# EAGLE design proto_shield_MEGA-REV3 (EAGLE 6.4)
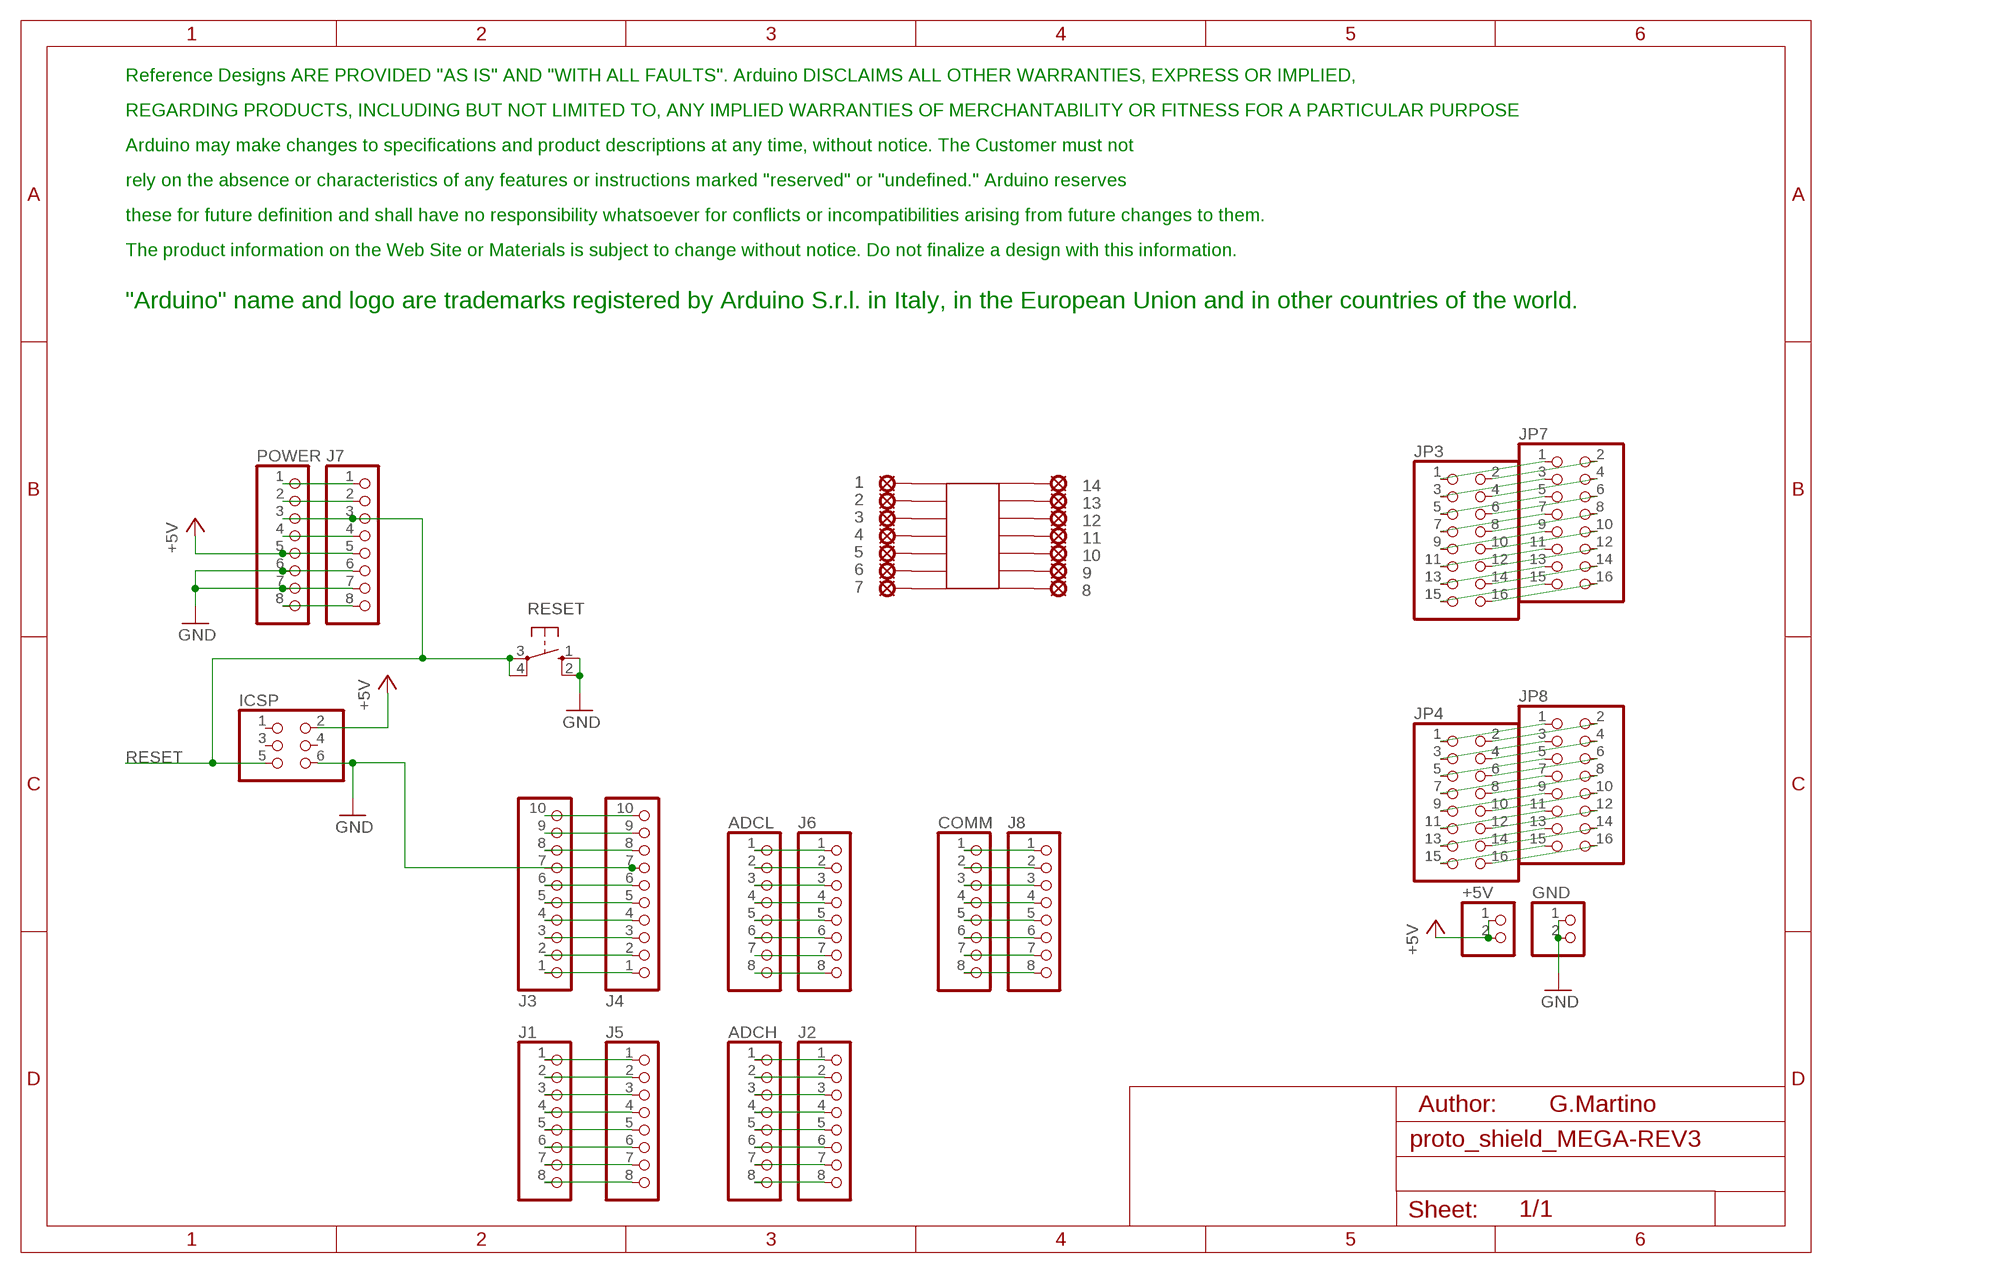
[diagram p0: schematic, sheet 1]

## Parts
1  LSP10  [LSP10]
2  LSP10  [LSP10]
3  LSP10  [LSP10]
4  LSP10  [LSP10]
5  LSP10  [LSP10]
6  LSP10  [LSP10]
7  LSP10  [LSP10]
8  LSP10  [LSP10]
9  LSP10  [LSP10]
10  LSP10  [LSP10]
11  LSP10  [LSP10]
12  LSP10  [LSP10]
13  LSP10  [LSP10]
14  LSP10  [LSP10]
+5V  PINHD-1X2  [1X02]
ADCH  PINHD-1X8TH  [1X08-TH]
ADCL  PINHD-1X8TH  [1X08-TH]
COMM  PINHD-1X8TH  [1X08-TH]
GND  PINHD-1X2  [1X02]
IC2  SMD-14  [SO-14NMW]
ICSP  PINHD-2X3  [2X03]
J1  PINHD-1X8TH  [1X08-TH]
J2  PINHD-1X8TH  [1X08-TH]
J3  PINHD-1X10TH  [1X10-TH]
J4  PINHD-1X10TH  [1X10-TH]
J5  PINHD-1X8TH  [1X08-TH]
J6  PINHD-1X8TH  [1X08-TH]
J7  PINHD-1X8TH  [1X08-TH]
J8  PINHD-1X8TH  [1X08-TH]
JP3  PINHD-2X8  [2X08]
JP4  PINHD-2X8  [2X08]
JP7  PINHD-2X8  [2X08]
JP8  PINHD-2X8  [2X08]
POWER  PINHD-1X8TH  [1X08-TH]
RESET  10-XX  [B3F-10XX]
U$1  DISCLAIMER_MINI  [DISCLAIMER]

## Nets
+5V: +5V.1 +5V.2 ICSP.2 J7.5 POWER.5
+9V: J7.8 POWER.8
GND: GND.1 GND.2 ICSP.6 J3.7 J4.7 J7.6 J7.7 POWER.6 POWER.7 RESET.1(S) RESET.2(S1)
N$2: J3.1 J4.1
N$3: J3.6 J4.6
N$5: J3.4 J4.4
N$6: J3.2 J4.2
N$7: J3.3 J4.3
N$8: J1.1 J5.1
N$9: J1.2 J5.2
N$10: J1.3 J5.3
N$11: J1.4 J5.4
N$12: J1.5 J5.5
N$13: J1.6 J5.6
N$14: J1.7 J5.7
N$15: J1.8 J5.8
N$18: ADCL.1 J6.1
N$19: ADCL.2 J6.2
N$20: ADCL.3 J6.3
N$21: ADCL.4 J6.4
N$22: ADCL.5 J6.5
N$23: ADCL.6 J6.6
N$24: 14.MP IC2.P$14
N$38: ADCL.7 J6.7
N$63: ADCL.8 J6.8
N$64: ADCH.1 J2.1
N$88: ADCH.2 J2.2
N$89: ADCH.3 J2.3
N$97: 13.MP IC2.P$13
N$98: 12.MP IC2.P$12
N$99: 11.MP IC2.P$11
N$100: 10.MP IC2.P$10
N$101: 9.MP IC2.P$9
N$102: 8.MP IC2.P$8
N$103: 7.MP IC2.P$7
N$104: 6.MP IC2.P$6
N$109: 5.MP IC2.P$5
N$110: 3.MP IC2.P$3
N$111: 2.MP IC2.P$2
N$112: 1.MP IC2.P$1
N$113: 4.MP IC2.P$4
N$116: ADCH.4 J2.4
N$121: ADCH.5 J2.5
N$124: ADCH.6 J2.6
N$125: J7.4 POWER.4
N$126: J3.9 J4.9
N$127: ADCH.7 J2.7
N$128: ADCH.8 J2.8
N$129: COMM.1 J8.1
N$130: COMM.2 J8.2
N$133: COMM.3 J8.3
N$134: COMM.4 J8.4
N$136: COMM.5 J8.5
N$137: COMM.6 J8.6
N$138: COMM.7 J8.7
N$139: COMM.8 J8.8
N$140: J3.5 J4.5
N$142: JP3.1 JP7.1
N$144: JP3.2 JP7.2
N$145: JP3.3 JP7.3
N$146: JP3.4 JP7.4
N$147: JP3.5 JP7.5
N$148: JP3.6 JP7.6
N$149: JP3.7 JP7.7
N$150: JP3.8 JP7.8
N$151: JP3.9 JP7.9
N$152: JP3.10 JP7.10
N$154: JP3.11 JP7.11
N$157: JP3.12 JP7.12
N$158: JP3.13 JP7.13
N$159: JP3.14 JP7.14
N$160: JP3.15 JP7.15
N$161: JP3.16 JP7.16
N$162: JP4.1 JP8.1
N$163: JP4.2 JP8.2
N$164: JP4.3 JP8.3
N$166: JP4.4 JP8.4
N$169: JP4.5 JP8.5
N$170: JP4.6 JP8.6
N$171: JP4.7 JP8.7
N$172: JP4.8 JP8.8
N$173: JP4.9 JP8.9
N$174: JP4.10 JP8.10
N$175: JP4.11 JP8.11
N$176: JP4.12 JP8.12
N$181: JP4.13 JP8.13
N$182: JP4.14 JP8.14
N$183: JP4.15 JP8.15
N$184: JP4.16 JP8.16
N$219: J7.2 POWER.2
N$220: J7.1 POWER.1
N$222: J3.8 J4.8
N$223: J3.10 J4.10
RESET: ICSP.5 J7.3 POWER.3 RESET.3(P) RESET.4(P1)
Unconnected: ICSP.1 ICSP.3 ICSP.4

## Notes on the sheet
- G.Martino

## Library data of the parts
1-14 = Smartprj:LSP10: SOLDER PAD drill 1.0 mm, distributor Buerklin, 12H555
+5V GND = pinhead:PINHD-1X2: PIN HEADER
ADCH ADCL COMM J1 J2 J5-J8 POWER = Smartprj:PINHD-1X8: PIN HEADER
IC2 = carduino:SMD-14
ICSP = Smartprj:PINHD-2X3: PIN HEADER
J3 J4 = Smartprj:PINHD-1X10: PIN HEADER
JP3 JP4 JP7 JP8 = pinhead:PINHD-2X8: PIN HEADER
RESET = switch-omron:10-XX: OMRON SWITCH
U$1 = Misc:DISCLAIMER_MINI

## Board
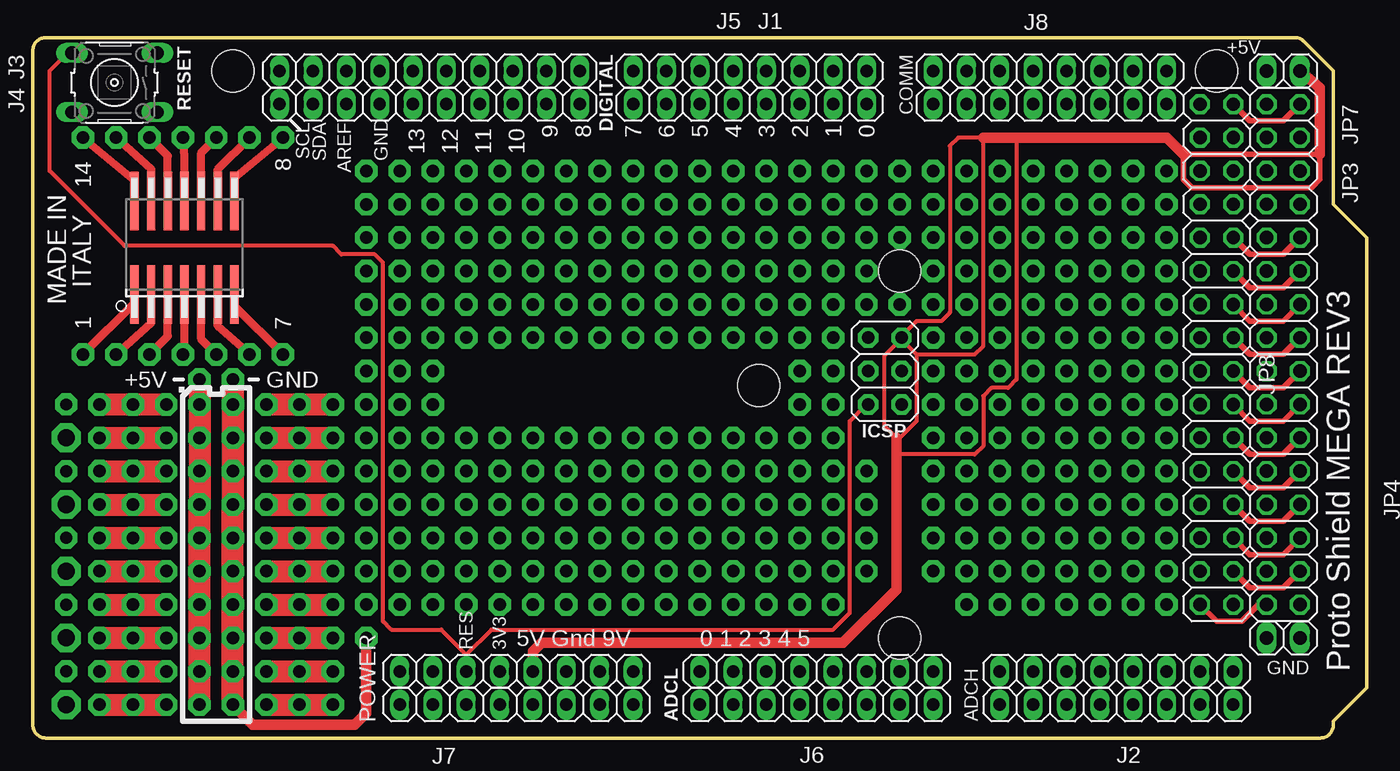
[diagram p1: board, top side]
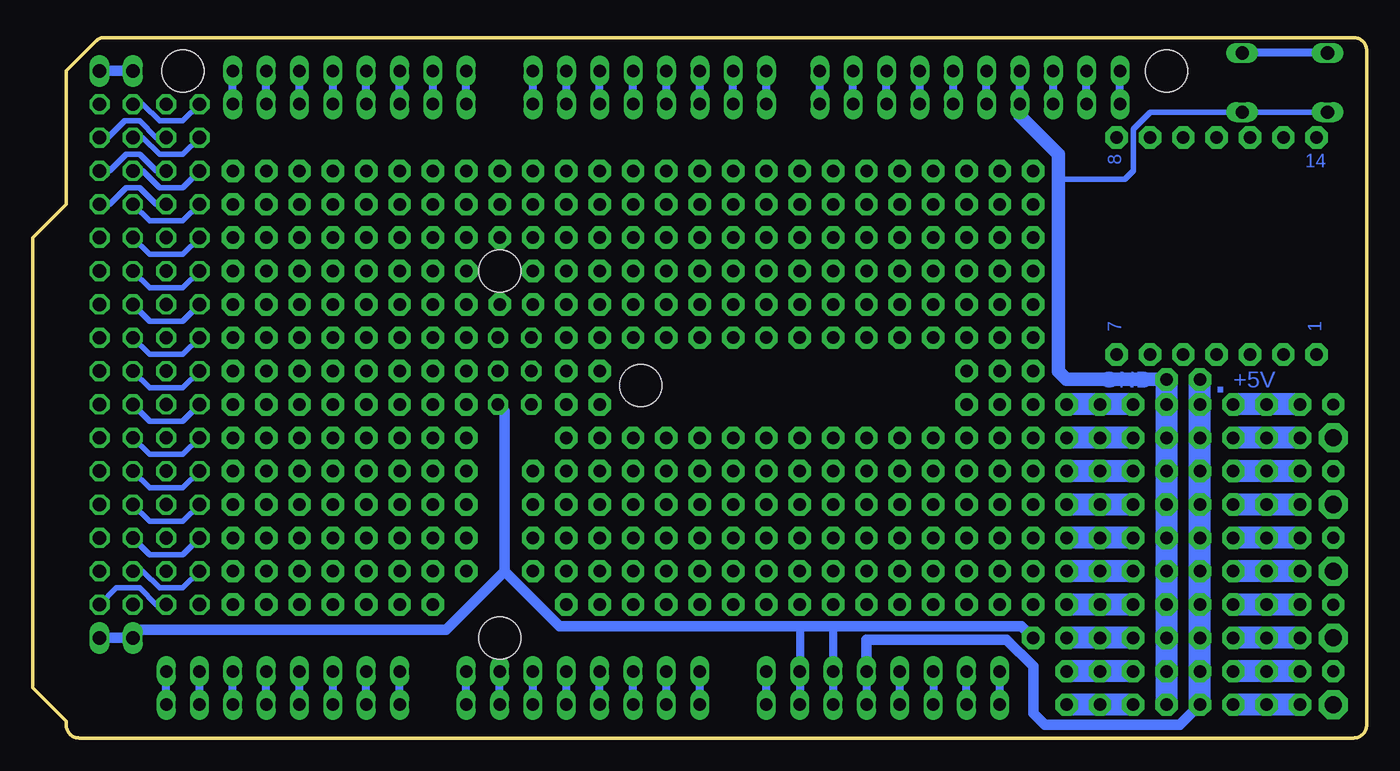
[diagram p2: board, bottom side, seen from below]

Size 101.6 x 53.34 mm. Coordinates in mm from the lower left corner, seen from the top.
Outline: 99.06,40.64 101.6,38.1 101.6,3.81 99.06,1.27 99.06,1 arc-90 98.06,0 1,0 arc-90 0,1 0,52.34 arc-90 1,53.34 96.11,53.34 arc-45 96.81,53.05 99.06,50.8 99.06,40.64
Copper layers (1*16): Top 0.035mm / dielectric 1.5mm / Bottom 0.035mm
Design rules "default *": minimum track width 10mil, minimum drill 24mil, track to track 8mil, track to pad 8mil, pad to pad 8mil, via to via 8mil, smd to smd 8mil, copper to edge 40mil, drill to drill 8mil, minimum pad ring 10mil, minimum via ring 8mil, stop-mask expansion 2mil, vias tented up to drill 0mil, thermal gap 10mil
Holes 3.2 mm at 15.24,50.8 66.04,7.62 55.3,26.84 66.04,35.56 90.17,50.8

### Footprints (pad centres in the part's own frame; a part is rotated, then mirrored left to right if it is on the bottom)
LSP10 = drill 0.95 pad 1.7 octagon: MP 0,0
1X02 = drill 1.016 long: 1 -1.27,0; 2 1.27,0
1X08-TH = drill 0.95 pad 1.422 long: 1 -8.89,0; 2 -6.35,0; 3 -3.81,0; 4 -1.27,0; 5 1.27,0; 6 3.81,0; 7 6.35,0; 8 8.89,0
SO-14NMW = smd 0.635 x 4.445: P$1 -3.048,-3.683; P$2 -1.778,-3.683; P$3 -0.508,-3.683; P$4 0.762,-3.683; P$5 2.032,-3.683; P$6 3.302,-3.683; P$7 4.572,-3.683; P$8 4.572,3.429; P$9 3.302,3.429; P$10 2.032,3.429; P$11 0.762,3.429; P$12 -0.508,3.429; P$13 -1.778,3.429; P$14 -3.048,3.429
2X03 = drill 0.95 pad 1.55 octagon: 1 -2.54,-1.27; 2 -2.54,1.27; 3 0,-1.27; 4 0,1.27; 5 2.54,-1.27; 6 2.54,1.27
1X10-TH = drill 0.95 pad 1.422 long: 1 -11.43,0; 2 -8.89,0; 3 -6.35,0; 4 -3.81,0; 5 -1.27,0; 6 1.27,0; 7 3.81,0; 8 6.35,0; 9 8.89,0; 10 11.43,0
2X08 = drill 1.016 octagon: 1 -8.89,-1.27; 2 -8.89,1.27; 3 -6.35,-1.27; 4 -6.35,1.27; 5 -3.81,-1.27; 6 -3.81,1.27; 7 -1.27,-1.27; 8 -1.27,1.27; 9 1.27,-1.27; 10 1.27,1.27; 11 3.81,-1.27; 12 3.81,1.27; 13 6.35,-1.27; 14 6.35,1.27; 15 8.89,-1.27; 16 8.89,1.27
B3F-10XX = drill 1.016 long: 1 -3.251,2.261; 2 3.251,2.261; 3 -3.251,-2.261; 4 3.251,-2.261

### Placement (x,y rotation side)
1  3.81,29.21 90 top
2  6.35,29.21 90 top
3  8.89,29.21 90 top
4  11.43,29.21 90 top
5  13.97,29.21 90 top
6  16.51,29.21 90 top
7  19.05,29.21 90 top
8  19.05,45.72 90 top
9  16.51,45.72 90 top
10  13.97,45.72 90 top
11  11.43,45.72 90 top
12  8.89,45.72 90 top
13  6.35,45.72 270 top
14  3.81,45.72 270 top
+5V  95.25,50.8 0 top
ADCH  82.55,2.54 0 top
ADCL  59.69,2.54 0 top
COMM  77.47,50.8 0 top
GND  95.25,7.62 0 top
IC2  10.79,37.47 0 top
ICSP  64.9,27.94 270 top
J1  54.61,50.8 180 top
J2  82.55,5.08 0 top
J3  30.23,50.8 180 top
J4  30.23,48.26 180 top
J5  54.61,48.26 180 top
J6  59.69,5.08 0 top
J7  36.83,2.54 0 top
J8  77.47,48.26 0 top
JP3  95.25,39.37 270 top
JP4  95.25,19.05 270 top
JP7  90.17,39.37 270 top
JP8  90.17,19.05 270 top
POWER  36.83,5.08 0 top
RESET  6.22,49.91 180 top
U$1  -5.71,-22.86 0 top  (outside the outline)

### Tracks (layer width: path | path; a pad name or v marks a point on that pad's centre or on a via)
+5V  (via drill 0.95 pad 1.7)
  Top 0.305: 66.17,30.4 64.87,29.11 64.87,23.77 65.79,22.86 | 66.17,30.61 67.31,31.75 69.22,31.75 69.85,32.38 69.85,45.09 70.48,45.72 72.39,45.72 72.39,29.84 71.75,29.21 67.31,29.21 | 66.17,30.35 67.31,29.21 | 67.31,29.21 67.31,24.13 66.04,22.86 | 66.04,21.59 71.75,21.59 72.39,22.23 72.39,26.04 73.03,26.67 74.3,26.67 74.93,27.3 74.93,45.72
  Top 0.406: 66.17,30.4 66.17,30.35 | 66.17,30.61 ICSP.2 | 87.63,44.45 98.04,44.45 98.04,42.55 97.41,41.91 88.27,41.91 87.63,42.55 87.63,44.45
  Top 0.813: POWER.5 38.1,6.6 38.73,7.24 61.72,7.24 65.79,11.3 65.79,22.86 | 72.39,45.72 74.93,45.72 86.36,45.72 87.63,44.45 | 98.04,44.45 98.04,49.53 +5V.2
  Top 1.676: v12.7,2.54 v12.7,5.08 v12.7,7.62 v12.7,10.16 v12.7,12.7 v12.7,15.24 v12.7,17.78 v12.7,20.32 v12.7,22.86 v12.7,25.4 v12.7,27.3
  Bottom 0.61: POWER.5 J7.5
  Bottom 0.813: POWER.5 38.1,7.49 27.43,7.49 25.4,5.46 25.4,1.91 24.51,1.02 14.22,1.02 v12.7,2.54 | +5V.2 +5V.1
  Bottom 1.676: v12.7,2.54 v12.7,27.3
+9V
  Bottom 0.61: J7.8 POWER.8
GND  (via drill 0.95 pad 1.7)
  Top 0.813: v25.4,7.62 25.4,1.91 24.51,1.02 16.76,1.02 v15.24,2.54
  Top 1.676: v15.24,2.54 v15.24,5.08 v15.24,7.62 v15.24,10.16 v15.24,12.7 v15.24,15.24 v15.24,17.78 v15.24,20.32 v15.24,22.86 v15.24,25.4 v15.24,27.3
  Bottom 0.406: RESET.2 3,47.62 3.81,47.62 3.83,47.65 RESET.1 16.48,47.65 17.78,46.35 17.78,43.18 18.41,42.55 23.5,42.55
  Bottom 0.61: J7.6 POWER.6 40.64,8.51 | J7.7 POWER.7 43.18,8.51 | 65.66,24.89 ICSP.6 | J4.7 J3.7
  Bottom 0.813: v25.4,7.62 26.29,8.51 40.64,8.51 43.18,8.51 61.47,8.51 65.66,12.7 | 65.66,12.7 65.66,24.89 | 26.42,47.37 J4.7 | 25.08,46.04 24.77,45.72 | GND.2 GND.1 93.34,8.26 70.1,8.26 65.66,12.7
  Bottom 1.016: 26.42,47.37 25.08,46.04 23.5,44.45 23.5,42.55 23.5,27.94 22.86,27.3 v15.24,27.3
  Bottom 1.676: v15.24,2.54 v15.24,27.3
N$2
  Bottom 0.61: J4.1 J3.1
N$3
  Bottom 0.61: J4.6 J3.6
N$4  (via drill 0.95 pad 1.7)
  other vias: 71.12,17.78
N$5
  Bottom 0.61: J4.4 J3.4
N$6
  Bottom 0.61: J4.2 J3.2
N$7
  Bottom 0.61: J4.3 J3.3
N$8
  Bottom 0.61: J5.1 J1.1
N$9
  Bottom 0.61: J5.2 J1.2
N$10
  Bottom 0.61: J5.3 J1.3
N$11
  Bottom 0.61: J5.4 J1.4
N$12
  Bottom 0.61: J5.5 J1.5
N$13
  Bottom 0.61: J5.6 J1.6
N$14
  Bottom 0.61: J5.7 J1.7
N$15
  Bottom 0.61: J5.8 J1.8
N$16
  Bottom 1.676: 17.78,2.54 22.86,2.54
N$17
  Bottom 1.676: 17.78,5.08 22.86,5.08
N$18
  Bottom 0.61: ADCL.1 J6.1
N$19
  Bottom 0.61: ADCL.2 J6.2
N$20
  Bottom 0.61: ADCL.3 J6.3
N$21
  Bottom 0.61: ADCL.4 J6.4
N$22
  Bottom 0.61: ADCL.5 J6.5
N$23
  Bottom 0.61: ADCL.6 J6.6
N$24
  Top 0.61: IC2.P$14 7.75,42.42 14.MP
N$25
  Bottom 1.676: 17.78,7.62 22.86,7.62
N$26
  Bottom 1.676: 5.08,5.08 10.16,5.08
N$27  (via drill 0.95 pad 1.7)
  Top 1.676: v17.78,5.08 v22.86,5.08
N$28  (via drill 0.95 pad 1.7)
  other vias: 20.32,5.08
N$29  (via drill 1.3 pad 2.18)
  other vias: 2.54,17.78
N$30  (via drill 0.9 pad 1.68)
  other vias: 2.54,25.4
N$31
  Bottom 1.676: 5.08,10.16 10.16,10.16
N$32
  Bottom 1.676: 5.08,7.62 10.16,7.62
N$33  (via drill 0.95 pad 1.7)
  other vias: 7.62,5.08
N$34  (via drill 0.95 pad 1.7)
  Top 1.676: v5.08,5.08 v10.16,5.08
N$35  (via drill 1.3 pad 2.18)
  other vias: 2.54,22.86
N$36  (via drill 0.95 pad 1.7)
  other vias: 20.32,7.62
N$37  (via drill 0.95 pad 1.7)
  Top 1.676: v17.78,7.62 v22.86,7.62
N$38
  Bottom 0.61: ADCL.7 J6.7
N$39
  Bottom 1.676: 5.08,2.54 10.16,2.54
N$40  (via drill 0.9 pad 1.68)
  other vias: 2.54,5.08
N$41  (via drill 0.95 pad 1.7)
  Top 1.676: v5.08,7.62 v10.16,7.62
N$42  (via drill 0.95 pad 1.7)
  other vias: 7.62,7.62
N$43
  Bottom 1.676: 5.08,12.7 10.16,12.7
N$44  (via drill 1.3 pad 2.18)
  other vias: 2.54,7.62
N$45  (via drill 0.95 pad 1.7)
  other vias: 45.72,10.16
N$46  (via drill 0.95 pad 1.7)
  other vias: 27.94,10.16
N$47  (via drill 0.95 pad 1.7)
  other vias: 25.4,10.16
N$48  (via drill 0.95 pad 1.7)
  Top 1.676: v17.78,10.16 v22.86,10.16
N$49  (via drill 0.95 pad 1.7)
  other vias: 20.32,10.16
N$50
  Bottom 1.676: 5.08,15.24 10.16,15.24
N$51
  Bottom 1.676: 5.08,17.78 10.16,17.78
N$52
  Bottom 1.676: 5.08,20.32 10.16,20.32
N$53
  Bottom 1.676: 5.08,22.86 10.16,22.86
N$54  (via drill 0.95 pad 1.7)
  other vias: 7.62,10.16
N$55  (via drill 0.95 pad 1.7)
  Top 1.676: v5.08,10.16 v10.16,10.16
N$56  (via drill 0.9 pad 1.68)
  other vias: 2.54,10.16
N$57  (via drill 0.95 pad 1.7)
  other vias: 53.34,12.7
N$58  (via drill 0.95 pad 1.7)
  other vias: 27.94,12.7
N$59  (via drill 0.95 pad 1.7)
  other vias: 25.4,12.7
N$60
  Bottom 1.676: 5.08,25.4 10.16,25.4
N$61  (via drill 0.95 pad 1.7)
  other vias: 20.32,12.7
N$62  (via drill 0.95 pad 1.7)
  Top 1.676: v17.78,12.7 v22.86,12.7
N$63
  Bottom 0.61: ADCL.8 J6.8
N$64
  Bottom 0.61: ADCH.1 J2.1
N$65  (via drill 0.95 pad 1.7)
  Top 1.676: v5.08,12.7 v10.16,12.7
N$66  (via drill 0.95 pad 1.7)
  other vias: 7.62,12.7
N$67  (via drill 0.95 pad 1.7)
  Top 1.676: v5.08,22.86 v10.16,22.86
N$68  (via drill 1.3 pad 2.18)
  other vias: 2.54,12.7
N$69  (via drill 0.95 pad 1.7)
  other vias: 43.18,15.24
N$70  (via drill 0.95 pad 1.7)
  other vias: 27.94,15.24
N$71  (via drill 0.95 pad 1.7)
  other vias: 25.4,15.24
N$72  (via drill 0.95 pad 1.7)
  Top 1.676: v17.78,15.24 v22.86,15.24
N$73  (via drill 0.95 pad 1.7)
  other vias: 20.32,15.24
N$74  (via drill 0.95 pad 1.7)
  other vias: 7.62,22.86
N$75  (via drill 0.95 pad 1.7)
  other vias: 7.62,20.32
N$76  (via drill 0.95 pad 1.7)
  Top 1.676: v22.86,22.86 v20.32,22.86 v17.78,22.86
N$77  (via drill 0.95 pad 1.7)
  Top 1.676: v22.86,20.32 v20.32,20.32 v17.78,20.32
N$78  (via drill 0.95 pad 1.7)
  other vias: 7.62,15.24
N$79  (via drill 0.95 pad 1.7)
  Top 1.676: v5.08,15.24 v10.16,15.24
N$80  (via drill 0.9 pad 1.68)
  other vias: 2.54,15.24
N$81  (via drill 0.95 pad 1.7)
  other vias: 58.42,17.78
N$82  (via drill 0.95 pad 1.7)
  other vias: 27.94,17.78
N$83  (via drill 0.95 pad 1.7)
  other vias: 25.4,17.78
N$84  (via drill 0.95 pad 1.7)
  Top 1.676: v5.08,17.78 v10.16,17.78
N$85  (via drill 0.95 pad 1.7)
  other vias: 20.32,17.78
N$86  (via drill 0.95 pad 1.7)
  Top 1.676: v17.78,17.78 v22.86,17.78
N$87  (via drill 0.95 pad 1.7)
  Top 1.676: v5.08,20.32 v10.16,20.32
N$88
  Bottom 0.61: ADCH.2 J2.2
N$89
  Bottom 0.61: ADCH.3 J2.3
N$90  (via drill 0.95 pad 1.7)
  other vias: 7.62,17.78
N$91  (via drill 0.95 pad 1.7)
  other vias: 53.34,30.48
N$92  (via drill 0.9 pad 1.68)
  other vias: 2.54,20.32
N$93  (via drill 0.95 pad 1.7)
  other vias: 60.96,20.32
N$94  (via drill 0.95 pad 1.7)
  other vias: 27.94,20.32
N$95  (via drill 0.95 pad 1.7)
  other vias: 25.4,20.32
N$96  (via drill 0.95 pad 1.7)
  other vias: 58.42,30.48
N$97
  Top 0.61: IC2.P$13 9.02,43.31 13.MP
N$98
  Top 0.61: IC2.P$12 10.29,44.32 12.MP
N$99
  Top 0.61: IC2.P$11 11.56,44.32 11.MP
N$100
  Top 0.61: IC2.P$10 12.83,44.58 10.MP
N$101
  Top 0.61: IC2.P$9 14.1,43.31 9.MP
N$102
  Top 0.61: IC2.P$8 15.37,42.67 8.MP
N$103
  Top 0.61: IC2.P$7 15.37,32.89 7.MP
N$104
  Top 0.61: IC2.P$6 14.1,31.37 6.MP
N$105  (via drill 0.95 pad 1.7)
  other vias: 68.58,22.86
N$106  (via drill 0.95 pad 1.7)
  other vias: 27.94,22.86
N$107  (via drill 0.95 pad 1.7)
  other vias: 25.4,22.86
N$108  (via drill 0.95 pad 1.7)
  other vias: 60.96,27.94
N$109
  Top 0.61: IC2.P$5 12.83,30.35 5.MP
N$110
  Top 0.61: IC2.P$3 10.29,30.61 3.MP
N$111
  Top 0.61: IC2.P$2 9.02,31.62 2.MP
N$112
  Top 0.61: IC2.P$1 7.75,33.15 1.MP
N$113
  Top 0.61: IC2.P$4 11.56,29.21 4.MP
N$114  (via drill 0.95 pad 1.7)
  other vias: 58.42,27.94
N$115  (via drill 0.95 pad 1.7)
  other vias: 58.42,22.86
N$116
  Bottom 0.61: ADCH.4 J2.4
N$117  (via drill 0.95 pad 1.7)
  other vias: 60.96,25.4
N$118  (via drill 0.95 pad 1.7)
  Top 1.676: v22.86,25.4 v20.32,25.4 v17.78,25.4
N$119  (via drill 0.95 pad 1.7)
  other vias: 27.94,25.4
N$120  (via drill 0.95 pad 1.7)
  other vias: 25.4,25.4
N$121
  Bottom 0.61: ADCH.5 J2.5
N$122  (via drill 0.95 pad 1.7)
  other vias: 53.34,22.86
N$123  (via drill 0.95 pad 1.7)
  other vias: 25.4,43.18
N$124
  Bottom 0.61: ADCH.6 J2.6
N$125
  Bottom 0.61: J7.4 POWER.4
N$126
  Bottom 0.61: J4.9 J3.9
N$127
  Bottom 0.61: ADCH.7 J2.7
N$128
  Bottom 0.61: ADCH.8 J2.8
N$129
  Bottom 0.61: J8.1 COMM.1
N$130
  Bottom 0.61: J8.2 COMM.2
N$131  (via drill 0.95 pad 1.7)
  other vias: 27.94,27.94
N$132  (via drill 0.95 pad 1.7)
  other vias: 25.4,27.94
N$133
  Bottom 0.61: J8.3 COMM.3
N$134
  Bottom 0.61: J8.4 COMM.4
N$135  (via drill 0.95 pad 1.7)
  other vias: 25.4,30.48
N$136
  Bottom 0.61: J8.5 COMM.5
N$137
  Bottom 0.61: J8.6 COMM.6
N$138
  Bottom 0.61: J8.7 COMM.7
N$139
  Bottom 0.61: J8.8 COMM.8
N$140
  Bottom 0.61: J4.5 J3.5
N$141  (via drill 0.95 pad 1.7)
  other vias: 63.5,20.32
N$142
  Bottom 0.406: JP7.1 90.17,46.99 91.95,46.99 93.22,48.26 JP3.1
N$143  (via drill 0.95 pad 1.7)
  other vias: 27.94,30.48
N$144
  Top 0.406: JP3.2 95.25,46.99 92.71,46.99 JP7.2
N$145
  Bottom 0.406: JP7.3 90.17,44.45 91.95,44.45 93.22,45.72 JP3.3
N$146
  Bottom 0.406: JP3.4 95.89,45.72 94.61,46.99 93.47,46.99 92.2,45.72 JP7.4
N$147
  Bottom 0.406: JP7.5 90.17,41.91 91.95,41.91 93.22,43.18 JP3.5
N$148
  Bottom 0.406: JP3.6 95.76,43.18 94.49,44.45 93.47,44.45 92.2,43.18 JP7.6
N$149
  Bottom 0.406: JP7.7 90.17,39.37 92.71,39.37 JP3.7
N$150
  Bottom 0.406: JP3.8 95.76,40.64 94.49,41.91 93.47,41.91 92.2,40.64 JP7.8
N$151
  Bottom 0.406: JP7.9 90.17,36.83 92.71,36.83 JP3.9
N$152
  Top 0.406: JP3.10 95.25,36.83 92.71,36.83 JP7.10
N$153  (via drill 0.95 pad 1.7)
  other vias: 55.88,33.02
N$154
  Bottom 0.406: JP7.11 90.17,34.29 92.71,34.29 JP3.11
N$155  (via drill 0.95 pad 1.7)
  other vias: 27.94,33.02
N$156  (via drill 0.95 pad 1.7)
  other vias: 25.4,33.02
N$157
  Top 0.406: JP3.12 95.25,34.29 92.71,34.29 JP7.12
N$158
  Bottom 0.406: JP7.13 90.17,31.75 92.71,31.75 JP3.13
N$159
  Top 0.406: JP3.14 95.25,31.75 92.71,31.75 JP7.14
N$160
  Bottom 0.406: JP7.15 90.17,29.21 92.71,29.21 JP3.15
N$161
  Top 0.406: JP3.16 95.25,29.21 92.71,29.21 JP7.16
N$162
  Bottom 0.406: JP8.1 90.17,26.67 92.71,26.67 JP4.1
N$163
  Top 0.406: JP4.2 95.25,26.67 92.71,26.67 JP8.2
N$164
  Bottom 0.406: JP8.3 90.17,24.13 92.71,24.13 JP4.3
N$165  (via drill 0.95 pad 1.7)
  other vias: 50.8,35.56
N$166
  Top 0.406: JP4.4 95.25,24.13 92.71,24.13 JP8.4
N$167  (via drill 0.95 pad 1.7)
  other vias: 27.94,35.56
N$168  (via drill 0.95 pad 1.7)
  other vias: 25.4,35.56
N$169
  Bottom 0.406: JP8.5 90.17,21.59 92.71,21.59 JP4.5
N$170
  Top 0.406: JP4.6 95.25,21.59 92.71,21.59 JP8.6
N$171
  Bottom 0.406: JP8.7 90.17,19.05 92.71,19.05 JP4.7
N$172
  Top 0.406: JP4.8 95.25,19.05 92.71,19.05 JP8.8
N$173
  Bottom 0.406: JP8.9 90.17,16.51 92.71,16.51 JP4.9
N$174
  Top 0.406: JP4.10 95.25,16.51 92.71,16.51 JP8.10
N$175
  Bottom 0.406: JP8.11 90.17,13.97 92.71,13.97 JP4.11
N$176
  Top 0.406: JP4.12 95.25,13.97 92.71,13.97 JP8.12
N$177  (via drill 0.95 pad 1.7)
  other vias: 43.18,38.1
N$178  (via drill 0.95 pad 1.7)
  Top 1.676: v5.08,25.4 v10.16,25.4
N$179  (via drill 0.95 pad 1.7)
  other vias: 27.94,38.1
N$180  (via drill 0.95 pad 1.7)
  other vias: 25.4,38.1
N$181
  Bottom 0.406: JP8.13 90.17,11.43 91.95,11.43 93.22,12.7 JP4.13
N$182
  Top 0.406: JP4.14 95.25,11.43 92.71,11.43 JP8.14
N$183
  Top 0.406: JP8.15 90.17,8.89 92.08,8.89 93.34,10.16 JP4.15
N$184
  Bottom 0.406: JP4.16 95.25,11.43 93.47,11.43 92.2,10.16 JP8.16
N$185  (via drill 0.95 pad 1.7)
  other vias: 68.58,38.1
N$186  (via drill 0.95 pad 1.7)
  other vias: 68.58,33.02
N$187  (via drill 0.95 pad 1.7)
  other vias: 68.58,30.48
N$188  (via drill 0.95 pad 1.7)
  other vias: 68.58,27.94
N$189  (via drill 0.95 pad 1.7)
  other vias: 63.5,40.64
N$190  (via drill 0.95 pad 1.7)
  other vias: 7.62,25.4
N$191  (via drill 0.95 pad 1.7)
  other vias: 27.94,40.64
N$192  (via drill 0.95 pad 1.7)
  other vias: 25.4,40.64
N$193  (via drill 0.95 pad 1.7)
  other vias: 68.58,25.4
N$194  (via drill 0.95 pad 1.7)
  other vias: 68.58,20.32
N$195  (via drill 0.95 pad 1.7)
  other vias: 68.58,43.18
N$196  (via drill 0.95 pad 1.7)
  other vias: 68.58,40.64
N$197  (via drill 0.95 pad 1.7)
  other vias: 68.58,35.56
N$198  (via drill 0.95 pad 1.7)
  other vias: 71.12,33.02
N$199  (via drill 0.95 pad 1.7)
  other vias: 71.12,30.48
N$200  (via drill 0.95 pad 1.7)
  other vias: 71.12,27.94
N$201  (via drill 0.95 pad 1.7)
  other vias: 38.1,43.18
N$202  (via drill 0.95 pad 1.7)
  other vias: 71.12,25.4
N$203  (via drill 0.95 pad 1.7)
  other vias: 27.94,43.18
N$204  (via drill 0.95 pad 1.7)
  other vias: 71.12,22.86
N$205  (via drill 0.95 pad 1.7)
  other vias: 71.12,20.32
N$206  (via drill 0.95 pad 1.7)
  other vias: 71.12,43.18
N$207  (via drill 0.95 pad 1.7)
  other vias: 71.12,40.64
N$208  (via drill 0.95 pad 1.7)
  other vias: 71.12,38.1
N$209  (via drill 0.95 pad 1.7)
  other vias: 71.12,35.56
N$210  (via drill 0.95 pad 1.7)
  other vias: 73.66,17.78
N$211  (via drill 0.95 pad 1.7)
  other vias: 73.66,33.02
N$212  (via drill 0.95 pad 1.7)
  other vias: 73.66,30.48
N$213  (via drill 0.95 pad 1.7)
  other vias: 73.66,27.94
N$214  (via drill 0.95 pad 1.7)
  other vias: 73.66,25.4
N$215  (via drill 0.95 pad 1.7)
  other vias: 73.66,22.86
N$216  (via drill 0.95 pad 1.7)
  other vias: 73.66,20.32
N$217  (via drill 0.95 pad 1.7)
  other vias: 73.66,43.18
N$218  (via drill 0.95 pad 1.7)
  other vias: 73.66,40.64
N$219
  Bottom 0.61: J7.2 POWER.2
N$220
  Bottom 0.61: J7.1 POWER.1
N$221  (via drill 0.95 pad 1.7)
  other vias: 73.66,38.1
N$222
  Bottom 0.61: J4.8 J3.8
N$223
  Bottom 0.61: J4.10 J3.10
N$224  (via drill 0.95 pad 1.7)
  other vias: 73.66,35.56
N$225  (via drill 0.95 pad 1.7)
  other vias: 76.2,17.78
N$226  (via drill 0.95 pad 1.7)
  other vias: 76.2,33.02
N$227  (via drill 0.95 pad 1.7)
  other vias: 30.48,38.1
N$228  (via drill 0.95 pad 1.7)
  other vias: 33.02,38.1
N$229  (via drill 0.95 pad 1.7)
  other vias: 30.48,35.56
N$230  (via drill 0.95 pad 1.7)
  other vias: 33.02,35.56
N$231  (via drill 0.95 pad 1.7)
  other vias: 30.48,33.02
N$232  (via drill 0.95 pad 1.7)
  other vias: 33.02,33.02
N$233  (via drill 0.95 pad 1.7)
  other vias: 35.56,35.56
N$234  (via drill 0.95 pad 1.7)
  other vias: 35.56,33.02
N$235  (via drill 0.95 pad 1.7)
  other vias: 33.02,30.48
N$236  (via drill 0.95 pad 1.7)
  other vias: 35.56,30.48
N$237  (via drill 0.95 pad 1.7)
  other vias: 38.1,33.02
N$238  (via drill 0.95 pad 1.7)
  other vias: 38.1,35.56
N$239  (via drill 0.95 pad 1.7)
  other vias: 38.1,30.48
N$240  (via drill 0.95 pad 1.7)
  other vias: 40.64,33.02
N$241  (via drill 0.95 pad 1.7)
  other vias: 40.64,35.56
N$242  (via drill 0.95 pad 1.7)
  other vias: 38.1,38.1
N$243  (via drill 0.95 pad 1.7)
  other vias: 35.56,38.1
N$244  (via drill 0.95 pad 1.7)
  other vias: 76.2,30.48
N$245  (via drill 0.95 pad 1.7)
  other vias: 33.02,40.64
N$246  (via drill 0.95 pad 1.7)
  other vias: 35.56,40.64
N$247  (via drill 0.95 pad 1.7)
  other vias: 30.48,40.64
N$248  (via drill 0.95 pad 1.7)
  other vias: 30.48,43.18
N$249  (via drill 0.95 pad 1.7)
  other vias: 33.02,43.18
N$250  (via drill 0.95 pad 1.7)
  other vias: 76.2,27.94
N$251  (via drill 0.95 pad 1.7)
  other vias: 30.48,30.48
N$252  (via drill 0.95 pad 1.7)
  other vias: 30.48,27.94
N$253  (via drill 0.95 pad 1.7)
  other vias: 76.2,25.4
N$254  (via drill 0.95 pad 1.7)
  other vias: 76.2,22.86
N$255  (via drill 0.95 pad 1.7)
  other vias: 76.2,20.32
N$256  (via drill 0.95 pad 1.7)
  other vias: 76.2,43.18
N$257  (via drill 0.95 pad 1.7)
  other vias: 76.2,40.64
N$258  (via drill 0.95 pad 1.7)
  other vias: 76.2,38.1
N$259  (via drill 0.95 pad 1.7)
  other vias: 33.02,22.86
N$260  (via drill 0.95 pad 1.7)
  other vias: 76.2,35.56
N$261  (via drill 0.95 pad 1.7)
  other vias: 35.56,22.86
N$262  (via drill 0.95 pad 1.7)
  other vias: 38.1,22.86
N$263  (via drill 0.95 pad 1.7)
  other vias: 40.64,22.86
N$264  (via drill 0.95 pad 1.7)
  other vias: 78.74,17.78
N$265  (via drill 0.95 pad 1.7)
  other vias: 78.74,33.02
N$266  (via drill 0.95 pad 1.7)
  other vias: 78.74,30.48
N$267  (via drill 0.95 pad 1.7)
  other vias: 43.18,30.48
N$268  (via drill 0.95 pad 1.7)
  other vias: 40.64,30.48
N$269  (via drill 0.95 pad 1.7)
  other vias: 45.72,30.48
N$270  (via drill 0.95 pad 1.7)
  other vias: 78.74,27.94
N$271  (via drill 0.95 pad 1.7)
  other vias: 30.48,25.4
N$272  (via drill 0.95 pad 1.7)
  other vias: 30.48,22.86
N$273  (via drill 0.95 pad 1.7)
  other vias: 30.48,20.32
N$274  (via drill 0.95 pad 1.7)
  other vias: 33.02,15.24
N$275  (via drill 0.95 pad 1.7)
  other vias: 33.02,17.78
N$276  (via drill 0.95 pad 1.7)
  other vias: 38.1,17.78
N$277  (via drill 0.95 pad 1.7)
  other vias: 35.56,17.78
N$278  (via drill 0.95 pad 1.7)
  other vias: 35.56,15.24
N$279  (via drill 0.95 pad 1.7)
  other vias: 30.48,15.24
N$280  (via drill 0.95 pad 1.7)
  other vias: 30.48,17.78
N$281  (via drill 0.95 pad 1.7)
  other vias: 38.1,20.32
N$282  (via drill 0.95 pad 1.7)
  other vias: 40.64,20.32
N$283  (via drill 0.95 pad 1.7)
  other vias: 38.1,15.24
N$284  (via drill 0.95 pad 1.7)
  other vias: 30.48,12.7
N$285  (via drill 0.95 pad 1.7)
  other vias: 33.02,12.7
N$286  (via drill 0.95 pad 1.7)
  other vias: 30.48,10.16
N$287  (via drill 0.95 pad 1.7)
  other vias: 78.74,25.4
N$288  (via drill 0.95 pad 1.7)
  other vias: 78.74,22.86
N$289  (via drill 0.95 pad 1.7)
  other vias: 33.02,10.16
N$290  (via drill 0.95 pad 1.7)
  other vias: 35.56,10.16
N$291  (via drill 0.95 pad 1.7)
  other vias: 35.56,12.7
N$292  (via drill 0.95 pad 1.7)
  other vias: 38.1,12.7
N$293  (via drill 0.95 pad 1.7)
  other vias: 40.64,17.78
N$294  (via drill 0.95 pad 1.7)
  other vias: 43.18,17.78
N$295  (via drill 0.95 pad 1.7)
  other vias: 43.18,20.32
N$296  (via drill 0.95 pad 1.7)
  other vias: 45.72,20.32
N$297  (via drill 0.95 pad 1.7)
  other vias: 45.72,22.86
N$298  (via drill 0.95 pad 1.7)
  other vias: 43.18,22.86
N$299  (via drill 0.95 pad 1.7)
  other vias: 48.26,22.86
N$300  (via drill 0.95 pad 1.7)
  other vias: 78.74,20.32
N$301  (via drill 0.95 pad 1.7)
  other vias: 78.74,43.18
N$302  (via drill 0.95 pad 1.7)
  other vias: 78.74,40.64
N$303  (via drill 0.95 pad 1.7)
  other vias: 78.74,38.1
N$304  (via drill 0.95 pad 1.7)
  other vias: 50.8,30.48
N$305  (via drill 0.95 pad 1.7)
  other vias: 48.26,30.48
N$306  (via drill 0.95 pad 1.7)
  other vias: 78.74,35.56
N$307  (via drill 0.95 pad 1.7)
  other vias: 45.72,33.02
N$308  (via drill 0.95 pad 1.7)
  other vias: 81.28,17.78
N$309  (via drill 0.95 pad 1.7)
  other vias: 50.8,33.02
N$310  (via drill 0.95 pad 1.7)
  other vias: 48.26,33.02
N$311  (via drill 0.95 pad 1.7)
  other vias: 43.18,33.02
N$312  (via drill 0.95 pad 1.7)
  other vias: 43.18,35.56
N$313  (via drill 0.95 pad 1.7)
  other vias: 45.72,35.56
N$314  (via drill 0.95 pad 1.7)
  other vias: 33.02,20.32
N$315  (via drill 0.95 pad 1.7)
  other vias: 35.56,20.32
N$316  (via drill 0.95 pad 1.7)
  other vias: 45.72,17.78
N$317  (via drill 0.95 pad 1.7)
  other vias: 48.26,20.32
N$318  (via drill 0.95 pad 1.7)
  other vias: 50.8,20.32
N$319  (via drill 0.95 pad 1.7)
  other vias: 50.8,22.86
N$320  (via drill 0.95 pad 1.7)
  other vias: 55.88,20.32
N$321  (via drill 0.95 pad 1.7)
  other vias: 68.58,17.78
N$322  (via drill 0.95 pad 1.7)
  other vias: 63.5,17.78
N$323  (via drill 0.95 pad 1.7)
  other vias: 60.96,17.78
N$324  (via drill 0.95 pad 1.7)
  other vias: 63.5,15.24
N$325  (via drill 0.95 pad 1.7)
  other vias: 63.5,12.7
N$326  (via drill 0.95 pad 1.7)
  other vias: 60.96,12.7
N$327  (via drill 0.95 pad 1.7)
  other vias: 58.42,12.7
N$328  (via drill 0.95 pad 1.7)
  other vias: 81.28,33.02
N$329  (via drill 1.3 pad 2.18)
  other vias: 2.54,2.54
N$330  (via drill 0.95 pad 1.7)
  other vias: 81.28,30.48
N$331  (via drill 0.95 pad 1.7)
  other vias: 7.62,2.54
N$332  (via drill 0.95 pad 1.7)
  Top 1.676: v5.08,2.54 v10.16,2.54
N$333  (via drill 0.95 pad 1.7)
  other vias: 81.28,27.94
N$334  (via drill 0.95 pad 1.7)
  other vias: 81.28,25.4
N$335  (via drill 0.95 pad 1.7)
  Top 1.676: v17.78,2.54 v22.86,2.54
N$336  (via drill 0.95 pad 1.7)
  other vias: 20.32,2.54
N$337  (via drill 0.95 pad 1.7)
  other vias: 81.28,22.86
N$340  (via drill 0.95 pad 1.7)
  other vias: 81.28,20.32
N$341  (via drill 0.95 pad 1.7)
  other vias: 81.28,43.18
N$342  (via drill 0.95 pad 1.7)
  other vias: 81.28,40.64
N$343  (via drill 0.95 pad 1.7)
  other vias: 81.28,38.1
N$344  (via drill 0.95 pad 1.7)
  other vias: 81.28,35.56
N$345  (via drill 0.95 pad 1.7)
  other vias: 83.82,17.78
N$346  (via drill 0.95 pad 1.7)
  other vias: 83.82,33.02
N$347  (via drill 0.95 pad 1.7)
  other vias: 83.82,30.48
N$348  (via drill 0.95 pad 1.7)
  other vias: 83.82,27.94
N$349  (via drill 0.95 pad 1.7)
  other vias: 83.82,25.4
N$350  (via drill 0.95 pad 1.7)
  other vias: 83.82,22.86
N$351  (via drill 0.95 pad 1.7)
  other vias: 83.82,20.32
N$352  (via drill 0.95 pad 1.7)
  other vias: 83.82,43.18
N$353  (via drill 0.95 pad 1.7)
  other vias: 60.96,10.16
N$354  (via drill 0.95 pad 1.7)
  other vias: 58.42,10.16
N$355  (via drill 0.95 pad 1.7)
  other vias: 55.88,10.16
N$356  (via drill 0.95 pad 1.7)
  other vias: 53.34,10.16
N$357  (via drill 0.95 pad 1.7)
  other vias: 50.8,10.16
N$358  (via drill 0.95 pad 1.7)
  other vias: 48.26,10.16
N$359  (via drill 0.95 pad 1.7)
  other vias: 40.64,10.16
N$360  (via drill 0.95 pad 1.7)
  other vias: 38.1,10.16
N$361  (via drill 0.95 pad 1.7)
  other vias: 43.18,10.16
N$362  (via drill 0.95 pad 1.7)
  other vias: 43.18,12.7
N$363  (via drill 0.95 pad 1.7)
  other vias: 40.64,12.7
N$364  (via drill 0.95 pad 1.7)
  other vias: 45.72,12.7
N$365  (via drill 0.95 pad 1.7)
  other vias: 48.26,12.7
N$366  (via drill 0.95 pad 1.7)
  other vias: 55.88,12.7
N$367  (via drill 0.95 pad 1.7)
  other vias: 50.8,12.7
N$368  (via drill 0.95 pad 1.7)
  other vias: 60.96,15.24
N$369  (via drill 0.95 pad 1.7)
  other vias: 58.42,15.24
N$370  (via drill 0.95 pad 1.7)
  other vias: 55.88,15.24
N$371  (via drill 0.95 pad 1.7)
  other vias: 53.34,15.24
N$372  (via drill 0.95 pad 1.7)
  other vias: 50.8,15.24
N$373  (via drill 0.95 pad 1.7)
  other vias: 48.26,15.24
N$374  (via drill 0.95 pad 1.7)
  other vias: 45.72,15.24
N$375  (via drill 0.95 pad 1.7)
  other vias: 40.64,15.24
N$376  (via drill 0.95 pad 1.7)
  other vias: 48.26,17.78
N$377  (via drill 0.95 pad 1.7)
  other vias: 50.8,17.78
N$378  (via drill 0.95 pad 1.7)
  other vias: 53.34,17.78
N$379  (via drill 0.95 pad 1.7)
  other vias: 55.88,17.78
N$380  (via drill 0.95 pad 1.7)
  other vias: 58.42,20.32
N$381  (via drill 0.95 pad 1.7)
  other vias: 53.34,20.32
N$382  (via drill 0.95 pad 1.7)
  other vias: 83.82,40.64
N$383  (via drill 0.95 pad 1.7)
  other vias: 55.88,22.86
N$384  (via drill 0.95 pad 1.7)
  other vias: 83.82,38.1
N$385  (via drill 0.95 pad 1.7)
  other vias: 60.96,22.86
N$386  (via drill 0.95 pad 1.7)
  other vias: 83.82,35.56
N$387  (via drill 0.95 pad 1.7)
  other vias: 86.36,17.78
N$388  (via drill 0.95 pad 1.7)
  other vias: 86.36,33.02
N$389  (via drill 0.95 pad 1.7)
  other vias: 86.36,30.48
N$390  (via drill 0.95 pad 1.7)
  other vias: 86.36,27.94
N$391  (via drill 0.95 pad 1.7)
  other vias: 86.36,25.4
N$392  (via drill 0.95 pad 1.7)
  other vias: 86.36,22.86
N$393  (via drill 0.95 pad 1.7)
  other vias: 58.42,25.4
N$394  (via drill 0.95 pad 1.7)
  other vias: 86.36,20.32
N$395  (via drill 0.95 pad 1.7)
  other vias: 55.88,30.48
N$396  (via drill 0.95 pad 1.7)
  other vias: 60.96,30.48
N$397  (via drill 0.95 pad 1.7)
  other vias: 66.04,33.02
N$398  (via drill 0.95 pad 1.7)
  other vias: 60.96,33.02
N$399  (via drill 0.95 pad 1.7)
  other vias: 58.42,33.02
N$400  (via drill 0.95 pad 1.7)
  other vias: 53.34,33.02
N$401  (via drill 0.95 pad 1.7)
  other vias: 63.5,35.56
N$402  (via drill 0.95 pad 1.7)
  other vias: 58.42,35.56
N$403  (via drill 0.95 pad 1.7)
  other vias: 60.96,35.56
N$404  (via drill 0.95 pad 1.7)
  other vias: 63.5,38.1
N$405  (via drill 0.95 pad 1.7)
  other vias: 60.96,38.1
N$406  (via drill 0.95 pad 1.7)
  other vias: 58.42,38.1
N$407  (via drill 0.95 pad 1.7)
  other vias: 55.88,38.1
N$408  (via drill 0.95 pad 1.7)
  other vias: 55.88,35.56
N$409  (via drill 0.95 pad 1.7)
  other vias: 53.34,38.1
N$410  (via drill 0.95 pad 1.7)
  other vias: 53.34,35.56
N$411  (via drill 0.95 pad 1.7)
  other vias: 48.26,35.56
N$412  (via drill 0.95 pad 1.7)
  other vias: 50.8,38.1
N$413  (via drill 0.95 pad 1.7)
  other vias: 48.26,38.1
N$414  (via drill 0.95 pad 1.7)
  other vias: 45.72,38.1
N$415  (via drill 0.95 pad 1.7)
  other vias: 40.64,38.1
N$416  (via drill 0.95 pad 1.7)
  other vias: 38.1,40.64
N$417  (via drill 0.95 pad 1.7)
  other vias: 43.18,40.64
N$418  (via drill 0.95 pad 1.7)
  other vias: 40.64,40.64
N$419  (via drill 0.95 pad 1.7)
  other vias: 45.72,40.64
N$420  (via drill 0.95 pad 1.7)
  other vias: 48.26,40.64
N$421  (via drill 0.95 pad 1.7)
  other vias: 50.8,40.64
N$422  (via drill 0.95 pad 1.7)
  other vias: 53.34,40.64
N$423  (via drill 0.95 pad 1.7)
  other vias: 55.88,40.64
N$424  (via drill 0.95 pad 1.7)
  other vias: 58.42,40.64
N$425  (via drill 0.95 pad 1.7)
  other vias: 60.96,40.64
N$426  (via drill 0.95 pad 1.7)
  other vias: 63.5,43.18
N$427  (via drill 0.95 pad 1.7)
  other vias: 60.96,43.18
N$428  (via drill 0.95 pad 1.7)
  other vias: 58.42,43.18
N$429  (via drill 0.95 pad 1.7)
  other vias: 55.88,43.18
N$430  (via drill 0.95 pad 1.7)
  other vias: 50.8,43.18
N$431  (via drill 0.95 pad 1.7)
  other vias: 53.34,43.18
N$432  (via drill 0.95 pad 1.7)
  other vias: 48.26,43.18
N$433  (via drill 0.95 pad 1.7)
  other vias: 45.72,43.18
N$434  (via drill 0.95 pad 1.7)
  other vias: 43.18,43.18
N$435  (via drill 0.95 pad 1.7)
  other vias: 40.64,43.18
N$436  (via drill 0.95 pad 1.7)
  other vias: 35.56,43.18
N$437  (via drill 0.95 pad 1.7)
  other vias: 86.36,43.18
N$438  (via drill 0.95 pad 1.7)
  other vias: 86.36,40.64
N$439  (via drill 0.95 pad 1.7)
  other vias: 86.36,38.1
N$440  (via drill 0.95 pad 1.7)
  other vias: 86.36,35.56
N$441  (via drill 0.95 pad 1.7)
  other vias: 68.58,15.24
N$442  (via drill 0.95 pad 1.7)
  other vias: 71.12,15.24
N$443  (via drill 0.95 pad 1.7)
  other vias: 73.66,15.24
N$444  (via drill 0.95 pad 1.7)
  other vias: 76.2,15.24
N$445  (via drill 0.95 pad 1.7)
  other vias: 78.74,15.24
N$446  (via drill 0.95 pad 1.7)
  other vias: 81.28,15.24
N$447  (via drill 0.95 pad 1.7)
  other vias: 83.82,15.24
N$448  (via drill 0.95 pad 1.7)
  other vias: 86.36,15.24
N$449  (via drill 0.95 pad 1.7)
  other vias: 68.58,12.7
N$450  (via drill 0.95 pad 1.7)
  other vias: 71.12,12.7
N$454  (via drill 0.95 pad 1.7)
  other vias: 73.66,12.7
N$455  (via drill 0.95 pad 1.7)
  other vias: 76.2,12.7
N$456  (via drill 0.95 pad 1.7)
  other vias: 78.74,12.7
N$457  (via drill 0.95 pad 1.7)
  other vias: 81.28,12.7
N$458  (via drill 0.95 pad 1.7)
  other vias: 83.82,12.7
N$459  (via drill 0.95 pad 1.7)
  other vias: 86.36,12.7
N$460  (via drill 0.95 pad 1.7)
  other vias: 63.5,33.02
N$461  (via drill 0.95 pad 1.7)
  other vias: 71.12,10.16
N$462  (via drill 0.95 pad 1.7)
  other vias: 73.66,10.16
N$463  (via drill 0.95 pad 1.7)
  other vias: 76.2,10.16
N$464  (via drill 0.95 pad 1.7)
  other vias: 78.74,10.16
N$465  (via drill 0.95 pad 1.7)
  other vias: 81.28,10.16
N$466  (via drill 0.95 pad 1.7)
  other vias: 83.82,10.16
N$467  (via drill 0.95 pad 1.7)
  other vias: 86.36,10.16
N$468  (via drill 0.95 pad 1.7)
  other vias: 66.04,38.1
N$469  (via drill 0.95 pad 1.7)
  other vias: 66.04,40.64
N$470  (via drill 0.95 pad 1.7)
  other vias: 66.04,43.18
N$471
  Bottom 1.676: 17.78,10.16 22.86,10.16
N$472
  Bottom 1.676: 17.78,12.7 22.86,12.7
N$473
  Bottom 1.676: 17.78,15.24 22.86,15.24
N$474
  Bottom 1.676: 17.78,17.78 22.86,17.78
N$475
  Bottom 1.676: 17.78,20.32 22.86,20.32
N$476
  Bottom 1.676: 17.78,22.86 22.86,22.86
N$477
  Bottom 1.676: 17.78,25.4 22.86,25.4
RESET
  Top 0.305: RESET.4 2.64,52.17 1.27,50.8 1.27,43.18 6.99,37.47 22.86,37.47 23.5,36.83 26.04,36.83 26.67,36.2 26.67,8.89 27.3,8.26 31.11,8.26 33.02,6.35 | 33.02,6.35 POWER.3 | ICSP.5 63.5,25.4 62.23,24.13 62.23,9.53 60.96,8.26 34.92,8.26 33.02,6.35
  Bottom 0.61: POWER.3 J7.3 | RESET.4 RESET.3

### Text on the board
Bottom: 8 | 14 | 1 | 7 | +5V | GND | .
tPlace: 9 | 8 | 7 | 6 | 5 | 4 | 3 | 2 | 1 | 0 | 13 | 12 | 11 | 10 | +5V | GND | . | Proto Shield MEGA REV3
tNames: DIGITAL | SCL | SDA | AREF | GND | ITALY | MADE IN | RES | 3V3 | 5V Gnd 9V | 0 1 2 3 4 5
bStop: DIGITAL | COMM | 5V | SCL | SDA | AREF | GND | 13 | 12 | 11 | 10 | 9 | 8 | 7 | 6 | 5 | 4 | 3 | 2 | 1 | 0 | TX3 | RX3 | TX2 | RX2 | TX1 | RX1 | SDA | SCL | 8 | 14 | 31 | 33 | 35 | 1 | 7 | 37 | 39 | +5V | GND | . | 41 | 43 | 45 | 47 | 49 | 51 | 53 | IOREF | RST | 3.3V | 5V | GND | GND | VIN | 0 | 1 | 2 | 3 | 4 | 5 | 7 | 8 | 9 | 10 | 11 | 12 | 13 | 14 | 15 | ANALOG | ANALOG | GND
Reference: USB | ETH